# Altium schematic sheet schematic.SchDoc
size A4; SheetNumber: 1; SheetTotal: 1
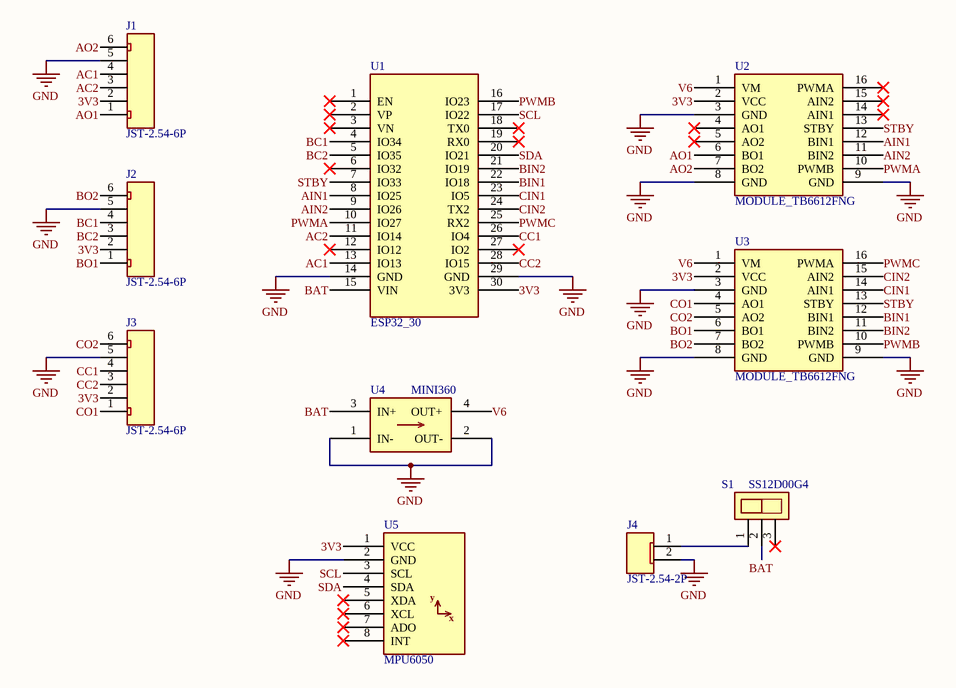
[diagram p0: schematic.SchDoc]

## Parts
J1  JST-2.54-6P  [JST-2.54-6P]
J2  JST-2.54-6P  [JST-2.54-6P]
J3  JST-2.54-6P  [JST-2.54-6P]
J4  JST-2.54-2P  [JST-2.54-2P]
S1  SS12D00G4  [SS12D00G4]
U1  ESP32_30  [ESP32_30]
U2  MODULE_TB6612FNG  [MODULE_TB6612FNG]
U3  MODULE_TB6612FNG  [MODULE_TB6612FNG]
U4  MINI360  [MINI360]
U5  MPU6050  [MPU6050]

## Nets
GND: J1.5 J2.5 J3.5 J4.2 U1.14(GND) U1.29(GND) U2.3(GND) U2.8(GND) U2.9(GND) U3.3(GND) U3.8(GND) U3.9(GND) U4.1(IN-) U4.2(OUT-) U5.2(GND)
3V3: J1.2 J2.2 J3.2 U1.30(3V3) U2.2(VCC) U3.2(VCC) U5.1(VCC)
AC1: J1.4 U1.13(IO13)
AC2: J1.3 U1.11(IO14)
AIN1: U1.8(IO25) U2.12(BIN1)
AIN2: U1.9(IO26) U2.11(BIN2)
AO1: J1.1 U2.6(BO1)
AO2: J1.6 U2.7(BO2)
BAT: S1.2 U1.15(VIN) U4.3(IN+)
BC1: J2.4 U1.4(IO34)
BC2: J2.3 U1.5(IO35)
BIN1: U1.22(IO18) U3.12(BIN1)
BIN2: U1.21(IO19) U3.11(BIN2)
BO1: J2.1 U3.6(BO1)
BO2: J2.6 U3.7(BO2)
CC1: J3.4 U1.26(IO4)
CC2: J3.3 U1.28(IO15)
CIN1: U1.23(IO5) U3.14(AIN1)
CIN2: U1.24(TX2) U3.15(AIN2)
CO1: J3.1 U3.4(AO1)
CO2: J3.6 U3.5(AO2)
PWMA: U1.10(IO27) U2.10(PWMB)
PWMB: U1.16(IO23) U3.10(PWMB)
PWMC: U1.25(RX2) U3.16(PWMA)
SCL: U1.17(IO22) U5.3(SCL)
SDA: U1.20(IO21) U5.4(SDA)
STBY: U1.7(IO33) U2.13(STBY) U3.13(STBY)
V6: U2.1(VM) U3.1(VM) U4.4(OUT+)
NetJ4_1: J4.1 S1.1

Not connected (* = marked no-connect by the designer): S1 3*; U1 1(EN)* 2(VP)* 3(VN)* 6(IO32)* 12(IO12)* 18(TX0)* 19(RX0)* 27(IO2)*; U2 4(AO1)* 5(AO2)* 14(AIN1)* 15(AIN2)* 16(PWMA)*; U5 5(XDA)* 6(XCL)* 7(ADO)* 8(INT)*

## Notes on the sheet
- (in symbol MPU6050) y; x

## Library data of the parts
J1-J3 = JST-2.54-6P: Female Connector JST 6 Vias, 2.54mm.
J4 = JST-2.54-2P: Female Connector JST 2 Vias, 2.54mm.
S1 = SS12D00G4: Vertical Slide Switch 3 Pins.
U1 = ESP32_30: Microcontoller Board 30 Pins Wifi 2.4GHz BLE 4.2 ESP32-WROOM-32D; ComponentLink1Description: Datasheet; ComponentLink1URL: https://www.mouser.com/datasheet/2/891/esp32_wroom_32d_esp32_wroom_32u_datasheet_en-1365844.pdf
U2 U3 = MODULE_TB6612FNG: Module Dual Motor Driver 2.5-13.5V 3.2A Peak 21x18mm; ComponentLink1Description: Datasheet; ComponentLink1URL: https://www.mouser.com/datasheet/2/408/TB6612FNG_datasheet_en_20141001-708260.pdf
U4 = MINI360: MODULE BUCK STEP DOWN 3A 18x12mm; ComponentLink1Description: Datasheet; ComponentLink1URL: https://cdn-shop.adafruit.com/datasheets/MP2307_r1.9.pdf
U5 = MPU6050: IMU ACCEL/GYRO 3-AXIS I2C; ComponentLink1Description: Datasheet; ComponentLink1URL: https://invensense.tdk.com/wp-content/uploads/2015/02/MPU-6000-Datasheet1.pdf